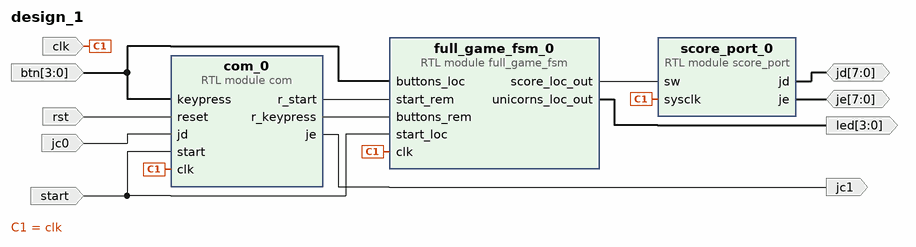
[diagram p0: block diagram of the top level]
# Vivado block design design_1, xc7z020clg400-1, Vivado 2020.2
create_bd_design design_1

create_bd_port -dir I clk
create_bd_port -dir I rst
create_bd_port -dir I -from 3 -to 0 btn
create_bd_port -dir O -from 3 -to 0 led
create_bd_port -dir IO -from 7 -to 0 jd
create_bd_port -dir IO -from 7 -to 0 je
create_bd_port -dir I jc0
create_bd_port -dir O jc1
create_bd_port -dir I start

create_bd_cell -type module -reference score_port score_port_0
create_bd_cell -type module -reference com com_0
create_bd_cell -type module -reference full_game_fsm full_game_fsm_0

# ---- connections ----

connect_bd_net [get_bd_ports clk] [get_bd_pins score_port_0/sysclk] [get_bd_pins com_0/clk] [get_bd_pins full_game_fsm_0/clk]
connect_bd_net [get_bd_ports rst] [get_bd_pins com_0/reset]
connect_bd_net [get_bd_ports btn] [get_bd_pins com_0/keypress] [get_bd_pins full_game_fsm_0/buttons_loc]
connect_bd_net [get_bd_ports jd] [get_bd_pins score_port_0/jd]
connect_bd_net [get_bd_ports je] [get_bd_pins score_port_0/je]
connect_bd_net -net jc0_1 [get_bd_ports jc0] [get_bd_pins com_0/jd]
connect_bd_net [get_bd_pins com_0/je] [get_bd_ports jc1]
connect_bd_net [get_bd_ports start] [get_bd_pins com_0/start] [get_bd_pins full_game_fsm_0/start_loc]
connect_bd_net [get_bd_pins com_0/r_start] [get_bd_pins full_game_fsm_0/start_rem]
connect_bd_net [get_bd_pins com_0/r_keypress] [get_bd_pins full_game_fsm_0/buttons_rem]
connect_bd_net [get_bd_pins full_game_fsm_0/unicorns_loc_out] [get_bd_ports led]
connect_bd_net [get_bd_pins full_game_fsm_0/score_loc_out] [get_bd_pins score_port_0/sw]

validate_bd_design
save_bd_design
